# Altium schematic sheet Power_ClockLed.SchDoc
size A4; SheetNumber: 3; SheetTotal: 8
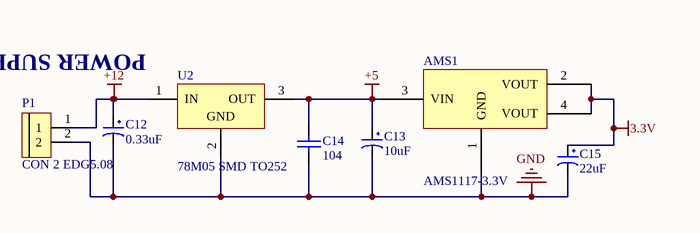
[diagram p0: Power_ClockLed.SchDoc]

## Parts
AMS1  AMS1117-3.3V  [SOT223]
C12  0.33uF  [tu hoa 5mm]
C13  10uF  [tu hoa 13mm]
C14  104  [tu 0805]
C15  22uF  [tu hoa 5mm]
P1  CON 2 EDG5.08  [CON 2 2EDG5.08]
U2  78M05 SMD TO252  [TO252]

## Nets
3.3V: AMS1.2(VOUT) AMS1.4(VOUT) C15.1
+5: AMS1.3(VIN) C13.1 C14.1 U2.3(OUT)
+12: C12.1 P1.1 U2.1(IN)
GND: AMS1.1(GND) C12.2 C13.2 C14.2 C15.2 P1.2 U2.2(GND)

## Notes on the sheet
- POWER SUPPLY

## Library data of the parts
AMS1 = AMS1117 SMD: Dán; Value: AMS1117-3.3V SOT223; Don_Vi: Con; Ma_Hang: MH000596; Ghi_Chu: *; Kieu_Chan: *; Chung_Loai: Dán
C12 = Tu Hoa 0.33uF 50V 5x11: Cắm; Don_Vi: Con; So_Chan: 2; Ten_Linh_Kien: Tụ Hóa 0.33uF 50V 5x11MM; Ma_Hang: MH004655; Chung_Loai: Cắm; Kieu_Chan: *
C13 = Tu Hoa 10uF 450V 13x20: Cắm; Don_Vi: Con; So_Chan: 2; Ten_Linh_Kien: Tụ Hóa 10uF 450V 13x20MM; Ma_Hang: MH003950; Chung_Loai: Cắm; Kieu_Chan: *
C14 = Tu 0805 104 50V 10%: Dán; Don_Vi: Con; So_Chan: 2; Ten_Linh_Kien: Tụ 0805 104-100nF 10% 50V; Ma_Hang: MH004551; Chung_Loai: Dán; Kieu_Chan: *
C15 = Tu Hoa 22uF 35V 5x11: Cắm; Don_Vi: Con; So_Chan: 2; Ten_Linh_Kien: Tụ Hóa 22uF 35V 5x11MM; Ma_Hang: MH001350; Chung_Loai: Cắm; Kieu_Chan: *
P1 = CON 2 EDG5.08: Cắm; Ten_Linh_Kien: CON 2 2EDG5.08-2P 5.08MM ( Xanh Cong); Ma_Hang: MH000759; Ghi_Chu: *; Don_Vi: Con; Kieu_Chan: *; Chung_Loai: Cắm
U2 = 78M05 SMD TO252: Dán; Don_Vi: Con; Ten_Linh_Kien: 78M05 TO252; Ma_Hang: MH001917; Ghi_Chu: *; Kieu_Chan: *; Chung_Loai: Dán